# Altium schematic sheet MCU.SchDoc
size A3; SheetNumber: 4; SheetTotal: 5
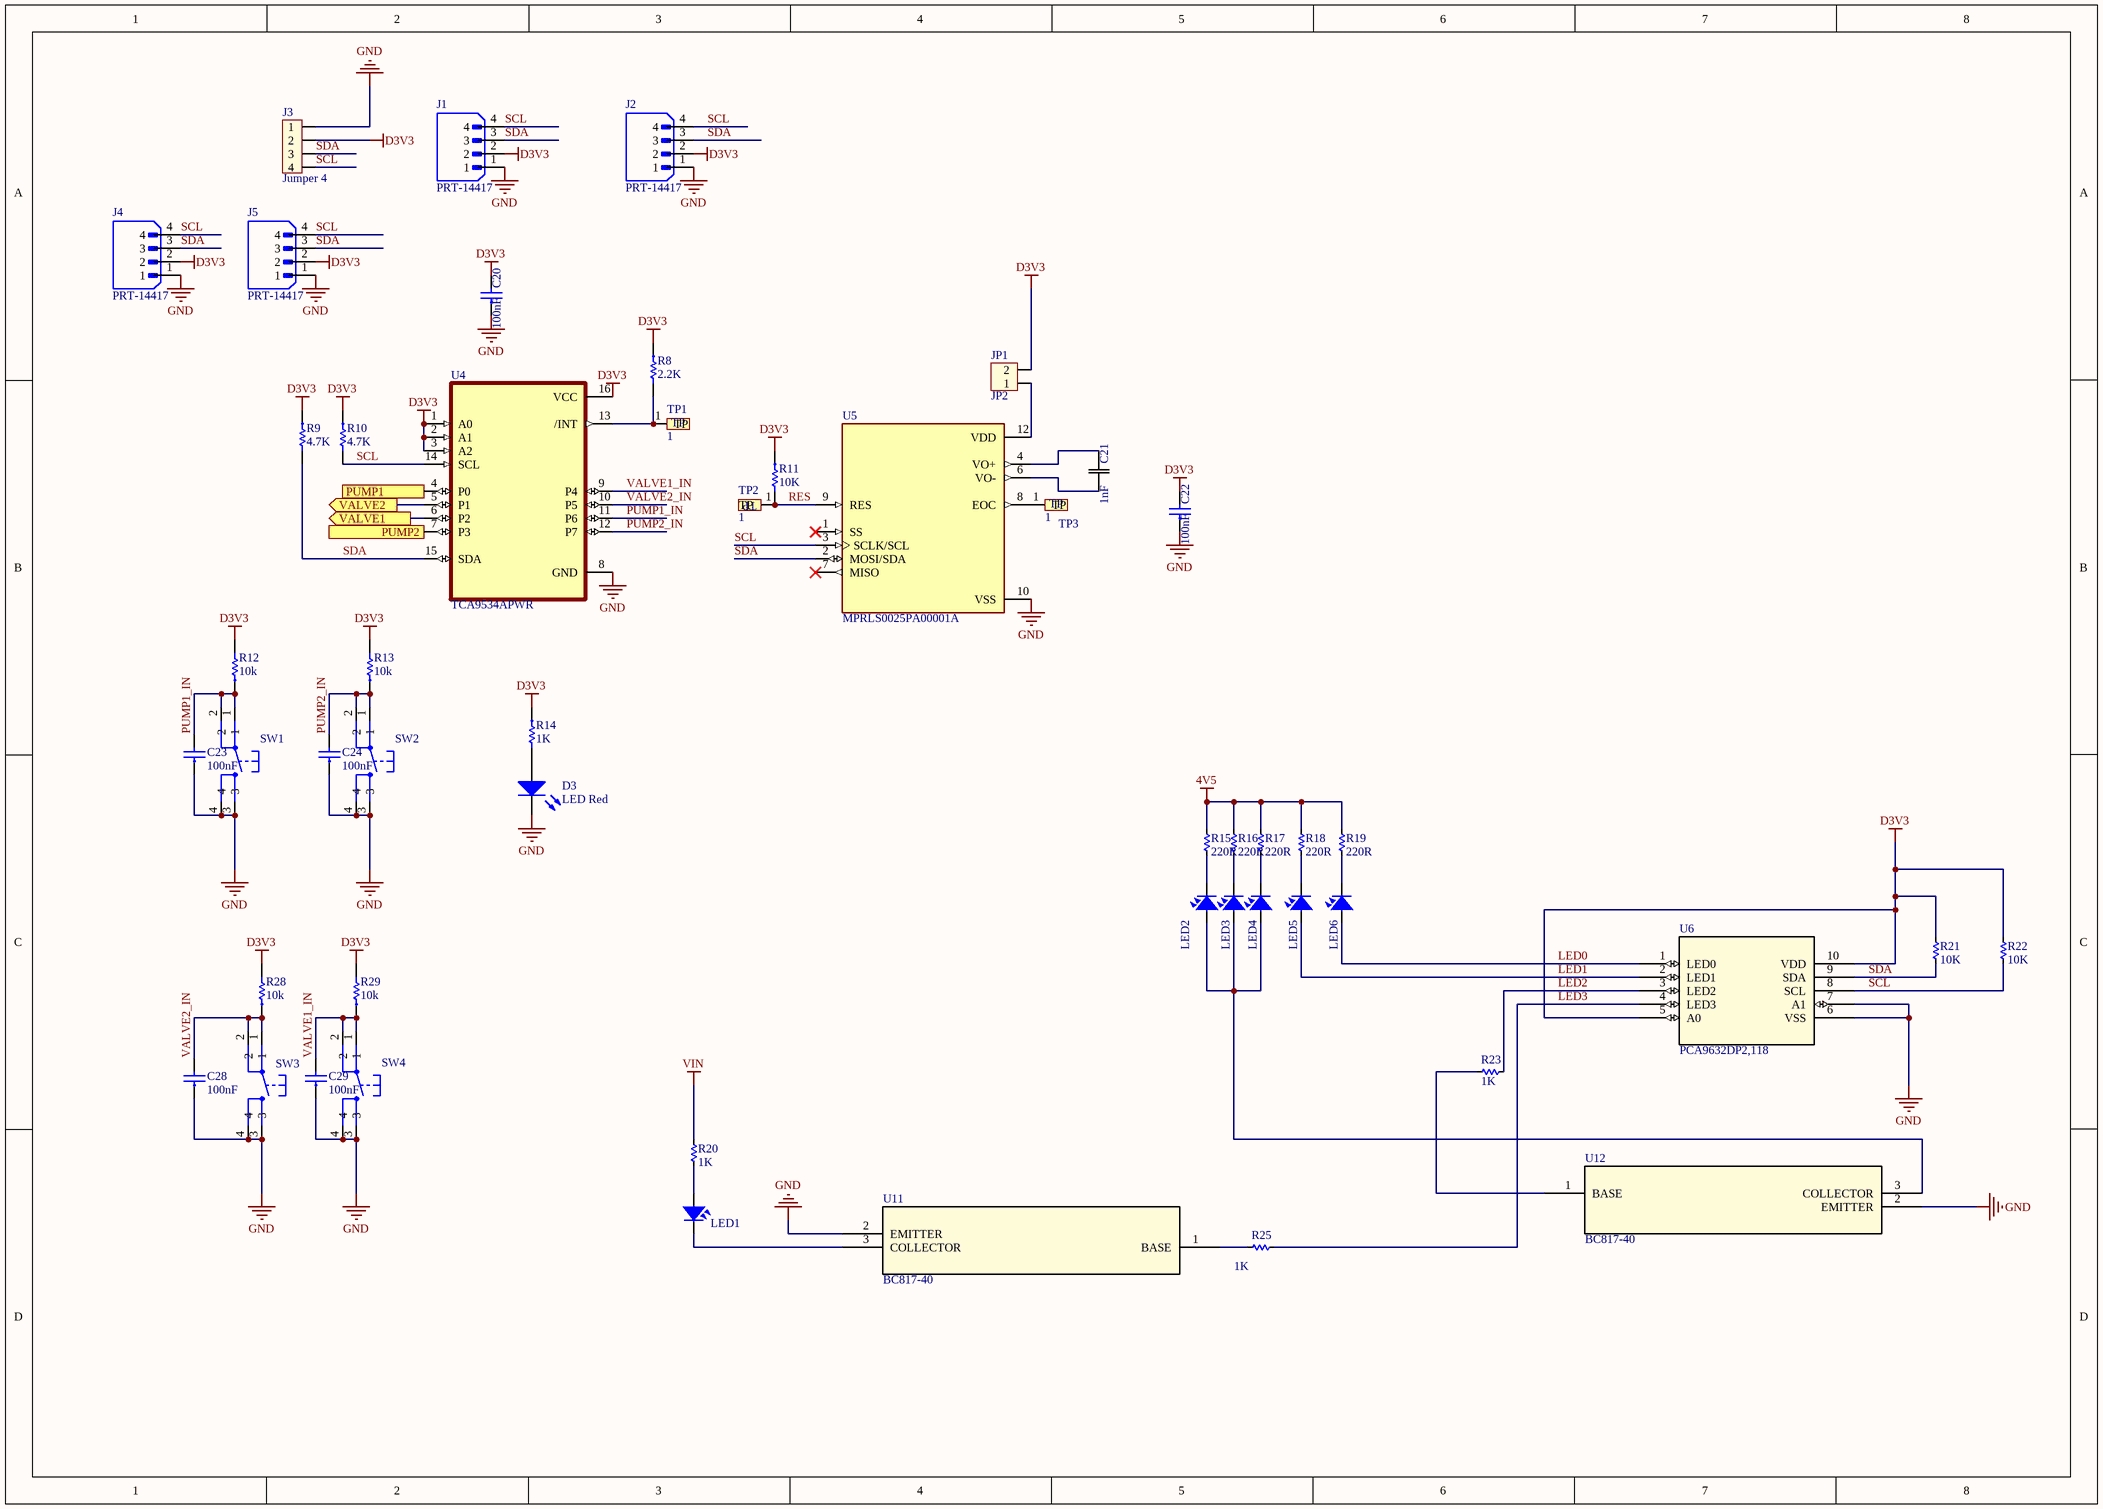
[diagram p0: MCU.SchDoc]

## Parts
C20  100nF  [CN-SMD-0603]
C21  1nF  [CN-SMD-0603]
C22  100nF  [CAP_CL10_SAM-L]
C23  100nF  [CN-SMD-0603]
C24  100nF  [CN-SMD-0603]
C28  100nF  [CN-SMD-0603]
C29  100nF  [CN-SMD-0603]
D3  LED Red  [LED-0805-Red]
J1  PRT-14417  [SPARKFUN_PRT-14417]
J2  PRT-14417  [SPARKFUN_PRT-14417]
J3  Jumper 4  [JP4]
J4  PRT-14417  [SPARKFUN_PRT-14417]
J5  PRT-14417  [SPARKFUN_PRT-14417]
JP1  JP2  [JP2-CLOSED]
LED1  LED  [LED-1206-Red]  (value not drawn)
LED2  LED  [LED-1206-Red]  (value not drawn)
LED3  LED  [LED-1206-Red]  (value not drawn)
LED4  LED  [LED-1206-Red]  (value not drawn)
LED5  LED  [LED-1206-Red]  (value not drawn)
LED6  LED  [LED-1206-Red]  (value not drawn)
R8  2.2K  [RES-SMD-0603]
R9  4.7K  [RES-SMD-0603]
R10  4.7K  [RES-SMD-0603]
R11  10K  [RES-SMD-0603]
R12  10k  [RES-SMD-0603]
R13  10k  [RES-SMD-0603]
R14  1K  [RES-SMD-0603]
R15  220R  [RES-SMD-0603]
R16  220R  [RES-SMD-0603]
R17  220R  [RES-SMD-0603]
R18  220R  [RES-SMD-0603]
R19  220R  [RES-SMD-0603]
R20  1K  [RES-SMD-0603]
R21  10K  [RES-SMD-0603]
R22  10K  [RES-SMD-0603]
R23  1K  [RES-SMD-0603]
R25  1K  [RES-SMD-0603]
R28  10k  [RES-SMD-0603]
R29  10k  [RES-SMD-0603]
SW1  SW2  [SW2-DIP]  (value not drawn)
SW2  SW2  [SW2-DIP]  (value not drawn)
SW3  SW2  [SW2-DIP]  (value not drawn)
SW4  SW2  [SW2-DIP]  (value not drawn)
TP1  1  [TP - 2]
TP2  1  [TP - 2]
TP3  1  [TP - 2]
U4  TCA9534APWR  [SOP65P640X120-16N]
U5  MPRLS0025PA00001A  [XDCR_MPRLS0025PA00001A]
U6  PCA9632DP2,118  [TSSOP10_3P1X3P1_NXP]
U11  BC817-40  [SOT23_NEX]
U12  BC817-40  [SOT23_NEX]

## Ports
PUMP1 (out), PUMP2 (out), VALVE1 (out), VALVE2 (out)

## Nets
4V5: R15.1 R16.1 R17.1 R18.1 R19.1
D3V3: C20.2 C22.2 J1.2 J2.2 J3.2 J4.2 J5.2 JP1.2 R8.1 R9.1 R10.1 R11.1 R12.2 R13.2 R14.1 R21.1 R22.1 R28.2 R29.2 U4.1(A0) U4.2(A1) U4.3(A2) U4.16(VCC) U6.5(A0) U6.10(VDD)
GND: C20.1 C22.1 C23.1 C24.1 C28.1 C29.1 D3.2(K) J1.1 J2.1 J3.1 J4.1 J5.1 SW1.3 SW1.4 SW2.3 SW2.4 SW3.3 SW3.4 SW4.3 SW4.4 U4.8(GND) U5.10(VSS) U6.6(VSS) U6.7(A1) U11.2(EMITTER) U12.2(EMITTER)
VIN: R20.1
LED0: LED6.1 U6.1(LED0)
LED1: LED5.1 U6.2(LED1)
LED2: R23.2 U6.3(LED2)
LED3: R25.1 U6.4(LED3)
PUMP1: U4.4(P0) ; port PUMP1
PUMP1_IN: C23.2 R12.1 SW1.1 SW1.2 U4.11(P6)
PUMP2: U4.7(P3) ; port PUMP2
PUMP2_IN: C24.2 R13.1 SW2.1 SW2.2 U4.12(P7)
RES: R11.2 TP2.1(TP) U5.9(RES)
SCL: J1.4 J2.4 J3.4 J4.4 J5.4 R10.2 R22.2 U4.14(SCL) U5.3(SCLK/SCL) U6.8(SCL)
SDA: J1.3 J2.3 J3.3 J4.3 J5.3 R9.2 R21.2 U4.15(SDA) U5.2(MOSI/SDA) U6.9(SDA)
VALVE1: U4.6(P2) ; port VALVE1
VALVE1_IN: C29.2 R29.1 SW4.1 SW4.2 U4.9(P4)
VALVE2: U4.5(P1) ; port VALVE2
VALVE2_IN: C28.2 R28.1 SW3.1 SW3.2 U4.10(P5)
NetC21_1: C21.1 U5.6(VO-)
NetC21_2: C21.2 U5.4(VO+)
NetD3_1: D3.1(A) R14.2
NetJP1_1: JP1.1 U5.12(VDD)
NetLED1_1: LED1.1 R20.2
NetLED1_2: LED1.2 U11.3(COLLECTOR)
NetLED2_1: LED2.1 LED3.1 LED4.1 U12.3(COLLECTOR)
NetLED2_2: LED2.2 R15.2
NetLED3_2: LED3.2 R16.2
NetLED4_2: LED4.2 R17.2
NetLED5_2: LED5.2 R18.2
NetLED6_2: LED6.2 R19.2
NetR8_2: R8.2 TP1.1(TP) U4.13(/INT)
NetR23_1: R23.1 U12.1(BASE)
NetR25_2: R25.2 U11.1(BASE)
NetTP3_1: TP3.1(TP) U5.8(EOC)

Not connected (* = marked no-connect by the designer): U5 1(SS)* 7(MISO)*

## Library data of the parts
C20 C22-C24 C28 C29 = CAPCER0001 100nF 10% 50V X7R 0603 SMD: CAP CER 100nF 10% 50V X7R 0603 SMD; LINE: SMT; TYPE: EP; UNIT: PCS; TMG CODE: None; CERTIFICATION: NA; CLASS: B; MOUNT: SMD; TMG PN: CAPCER0001; ComponentLink1Description: Datasheet; ComponentLink1URL: https://datasheet.lcsc.com/lcsc/1811021431_Samsung-Electro-Mechanics-CL10B104KB8NNNC_C1591.pdf; Footprint: 0603
C21 = GCJ188R71H102KA01D: No Description Available; Manufacturer_Name: Murata; Type: Ceramic Capacitors; Copyright: Copyright (C) 2026 Ultra Librarian. All rights reserved.; Manufacturer_Part_Number: GCJ188R71H102KA01D
D3 = LTST-C190KRKT: Lite-On LED Red 0603; Supplier Part Number 1: 160-1436-1-ND; Supplier 1: Digi-Key; Supplier Part Number 2: FL1413; Value: LED Red
J1 J2 J4 J5 = PRT-14417: QWIIC JST CONNECTOR - SMD 4-PIN; MF: SparkFun Electronics; SnapEDA_Link: https://www.snapeda.com/parts/PRT-14417/SparkFun+Electronics/view-part/?ref=snap; Package: None; Value: *; MP: PRT-14417; Check_prices: https://www.snapeda.com/parts/PRT-14417/SparkFun+Electronics/view-part/?ref=eda
J3 = JP4: Jumper 3; Value: J3
JP1 = Con2: jumper 2.0 B; Value: Connector 2
LED1-LED6 = LED: LED Single colour Green and Red; Value: LED 3 ly Single Colour
R8-R14 R28 R29 = RESCHP0428 8K4 1% 0603 SMD: RES CHP 8K4 1% 1/10W 0603 SMD; LINE: SMT; UNIT: PCS; TMG CODE: None; CERTIFICATION: NA; CLASS: B; MOUNT: SMD; TYPE: EP; ComponentLink1Description: Datasheet; ComponentLink1URL: https://datasheet.lcsc.com/lcsc/2304140030_YAGEO-RT0603FRD07100RL_C160603.pdf
R15-R23 R25 = Res-SMD: Resistor; Manufacturer: Generic Components; Class: Passive; Published: 08/06/2000; Publisher: Altium Hobart Technology Centre
SW1-SW4 = SW2: Switch button 4 pin
TP1-TP3 = TP: CONNECT 1
U4 = TCA9534APWR: 8-bit 1.65- to 5.5-V I2C/SMBus I/O expander with interrupt, & config registers; MF: Texas Instruments; SnapEDA_Link: https://www.snapeda.com/parts/TCA9534APWR/Texas+Instruments/view-part/?ref=snap; Package: TSSOP-16 Texas Instruments; Value: *; MP: TCA9534APWR; Check_prices: https://www.snapeda.com/parts/TCA9534APWR/Texas+Instruments/view-part/?ref=eda
U5 = MPRLS0025PA00001A: Pressure Sensor 25PSI _172.37kPa_ Absolute Male - 0.1 _2.5mm_ Tube 24 b 12-SMD Module; MF: Honeywell Sensing; MP: MPRLS0025PA00001A; SnapEDA_Link: https://www.snapeda.com/parts/MPRLS0025PA00001A/Honeywell%20Sensing%20and%20Productivity%20Solutions/view-part/2772767/?ref=snap; Digi-Key_Part_Number: 480-7098-1-ND; Package: SMD-10 Honeywell; Value: *
U6 = PCA9632DP2,118: No Description Available; Manufacturer_Name: NXP; Copyright: Copyright (C) 2026 Ultra Librarian. All rights reserved.; Manufacturer_Part_Number: PCA9632DP2,118; RefDes: RefDes; Type: Type
U11 U12 = BC817-40: No Description Available; Manufacturer_Name: Nexperia; Copyright: Copyright (C) 2026 Ultra Librarian. All rights reserved.; Manufacturer_Part_Number: BC817-40; RefDes: RefDes; Type: Type